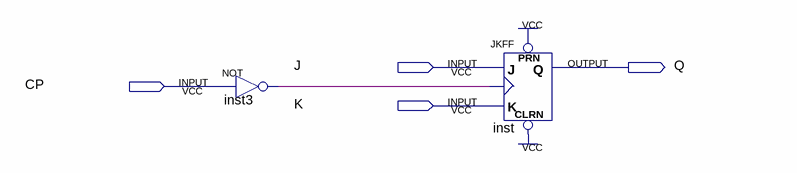
[diagram p0: schematic sheet]
// Quartus schematic Experiment51.bdf as structural Verilog: 2 symbols, 4 pins
module Experiment51 (
  input  J,
  input  CP,
  input  K,
  output Q
);

  wire inst3_out;

  not inst3 (inst3_out, CP);
  JKFF inst (.PRN(1'b1), .CLRN(1'b1), .K(K), .J(J), .CLK(inst3_out), .Q(Q));
endmodule
